# EAGLE design akabeacon_square (EAGLE 7.2.0)
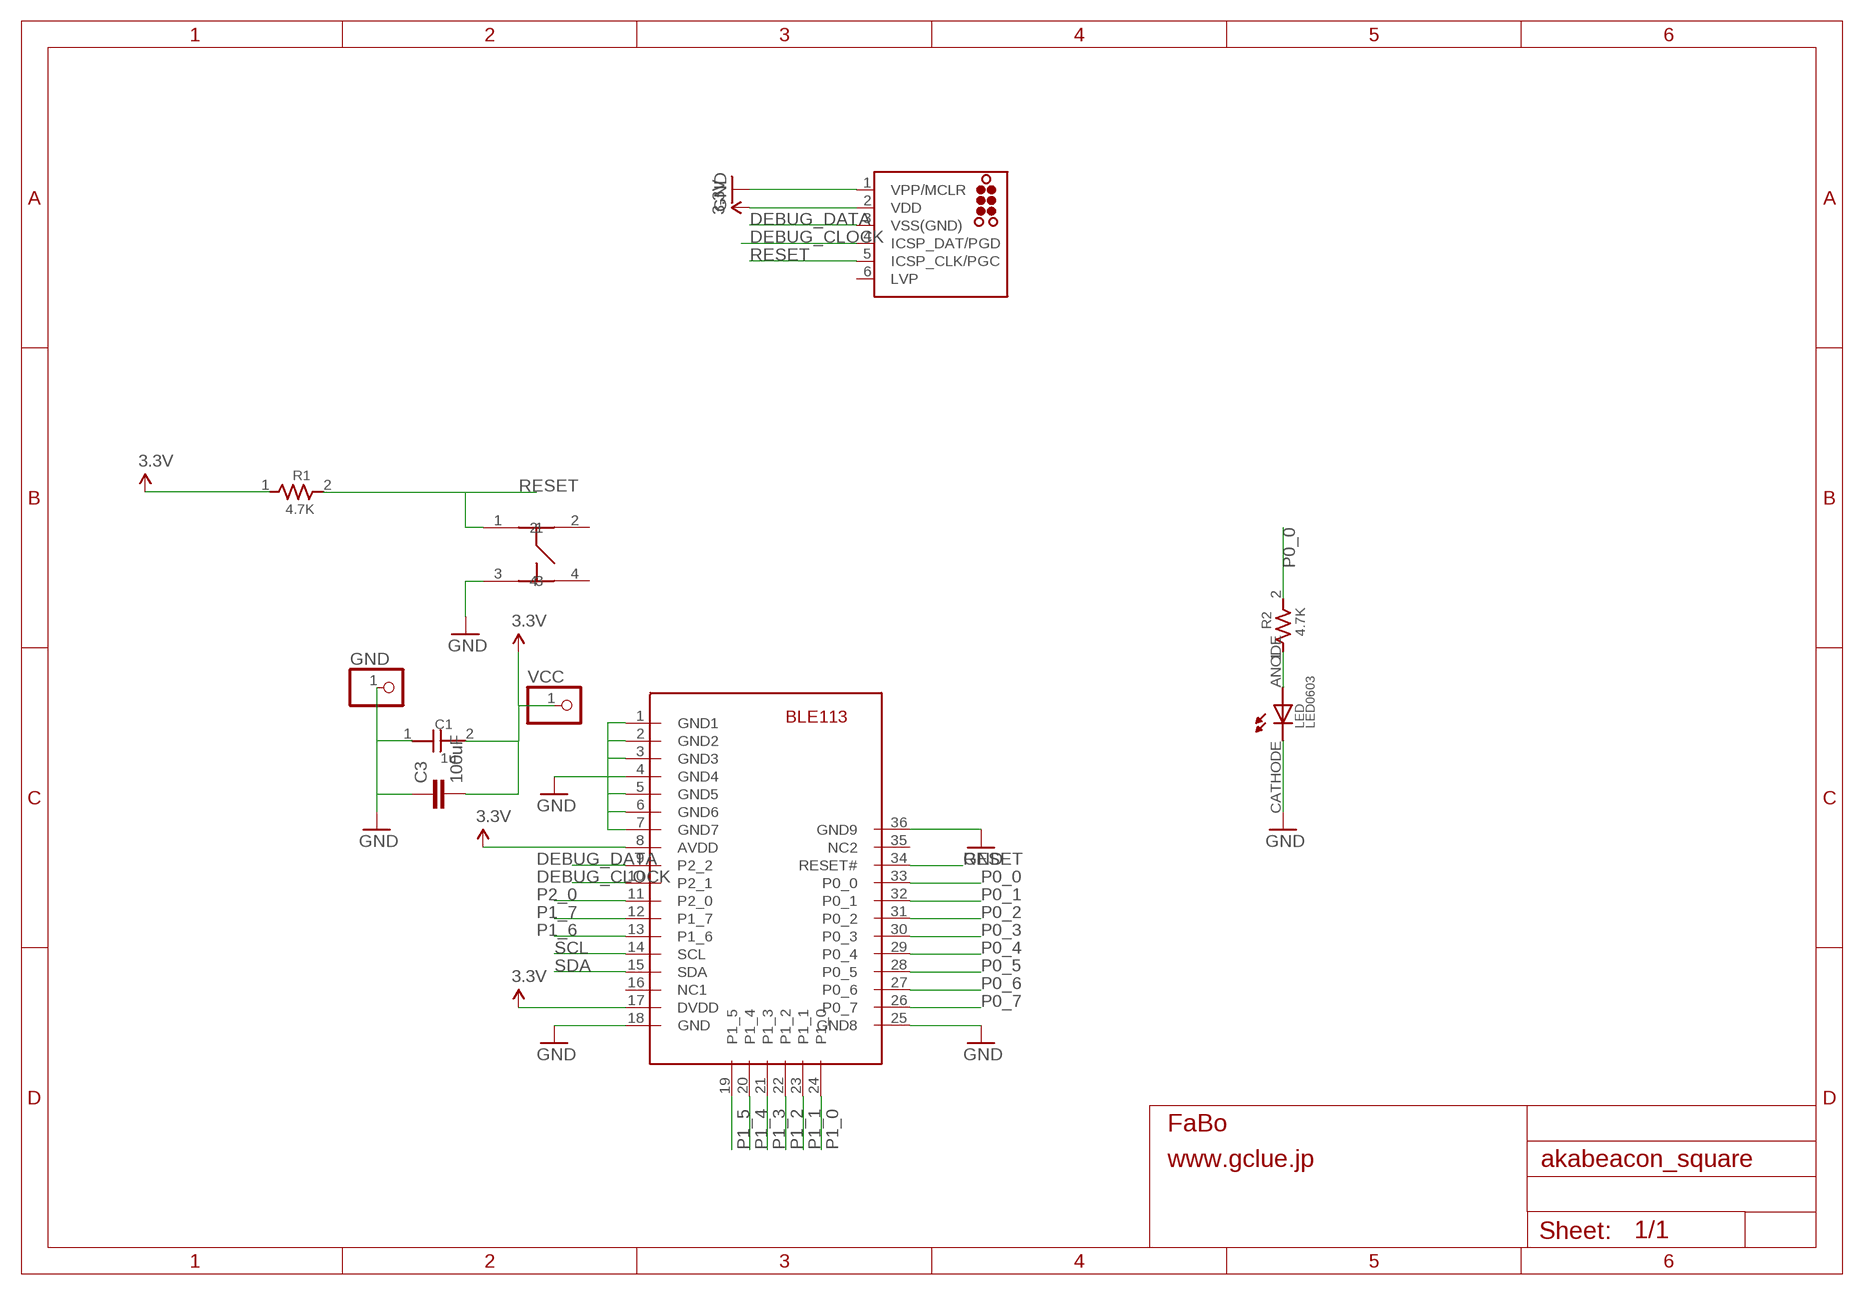
[diagram p0: schematic, sheet 1]

## Parts
C1  1u  CAPACITOR0603  [0603]
C3  100uF  10UF-6.3V-20%(1206)  [1206]
GND  PINHD-1X1CB  [1X01-CLEANBIG]
J1  TC2030-MCP  [TC2030-MCP]
LED  LED0603  [0603]
R1  4.7K  RESISTOR0603  [0603]
R2  4.7K  RESISTOR0603  [0603]
U$5  BLE113  [BLE113]
U$6  SWICTH-4P(KMR2)  [SWITCH-4P(KMR2)]
VCC  PINHD-1X1CB  [1X01-CLEANBIG]

## Nets
3.3V: C1.2 C3.2 J1.2(VDD) R1.1 U$5.8(AVDD) U$5.17(DVDD) VCC.1
DEBUG_CLOCK: J1.4(ICSP_DAT/PGD) U$5.10(P2_1)
DEBUG_DATA: J1.3(VSS(GND)) U$5.9(P2_2)
GND: C1.1 C3.1 GND.1 J1.1(VPP/MCLR) LED.CATHODE U$5.1(GND1) U$5.2(GND2) U$5.3(GND3) U$5.4(GND4) U$5.5(GND5) U$5.6(GND6) U$5.7(GND7) U$5.18(GND) U$5.25(GND8) U$5.36(GND9) U$6.3
N$2: LED.ANODE R2.1
P0_0: R2.2 U$5.33(P0_0)
P0_1: U$5.32(P0_1)
P0_2: U$5.31(P0_2)
P0_3: U$5.30(P0_3)
P0_4: U$5.29(P0_4)
P0_5: U$5.28(P0_5)
P0_6: U$5.27(P0_6)
P0_7: U$5.26(P0_7)
P1_0: U$5.24(P1_0)
P1_1: U$5.23(P1_1)
P1_2: U$5.22(P1_2)
P1_3: U$5.21(P1_3)
P1_4: U$5.20(P1_4)
P1_5: U$5.19(P1_5)
P1_6: U$5.13(P1_6)
P1_7: U$5.12(P1_7)
P2_0: U$5.11(P2_0)
RESET: J1.5(ICSP_CLK/PGC) R1.2 U$5.34(RESET#) U$6.1
SCL: U$5.14(SCL)
SDA: U$5.15(SDA)
Unconnected: J1.6(LVP) U$5.16(NC1) U$5.35(NC2) U$6.2 U$6.4

## Library data of the parts
C1 = GClue-Capacitor:CAPACITOR
C3 = SparkFun-Capacitors:10UF-6.3V-20%(1206): CAP-10057 Ceramic; PROD_ID: CAP-10057; VALUE: 10uF
GND VCC = adafruit:PINHD-1X1: Pin header 1x1 for 0.1" spacing With round pins
J1 = tag-connect:TC2030: TAG-CONNECT ICSP Connector Manufacturer: Tag-Connect <http://www.tag-connect.com> Cable for easy In-Circuit Serial Programming. Designed for Microchip ICD2, suitable for many others. Two variants - one "with legs" (for hands-free fit on PCB) and another "without legs" for quick programming. PAD Description 1 MCLR/Vpp 2 Vdd 3 GND 4 PGD (ISPDAT) 5 PGC (ISPCLK) 6 nc (used for LVP) ©2009 ROFA.cz - modified and updated by Robert Darlington ‹rdarlington@gmail.com›
LED = GClue-LED:LED
R1 R2 = GClue-Resistors:RESISTOR
U$5 = gclue:BLE113
U$6 = gclue:SWICTH-4P(KMR2)

## Board
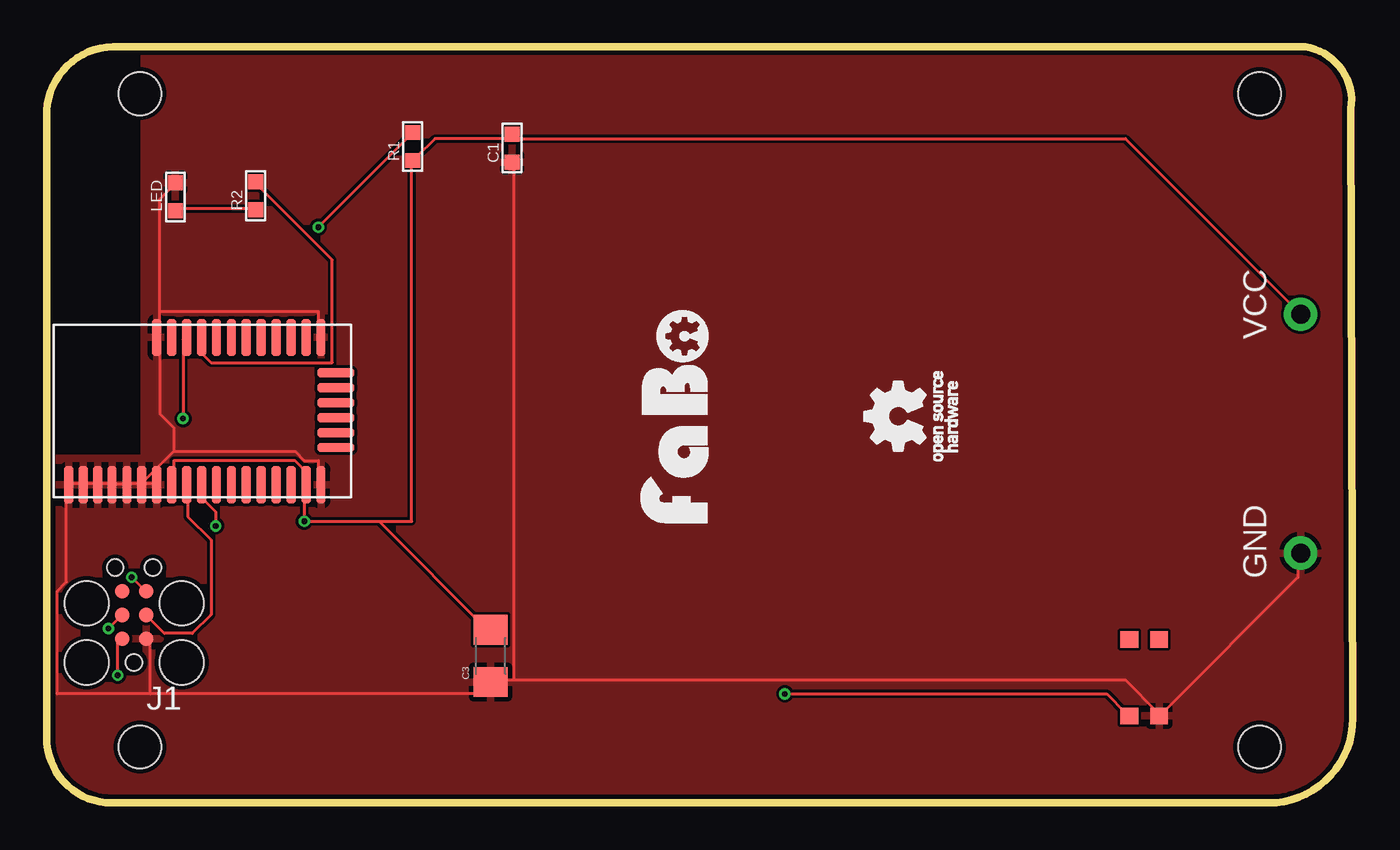
[diagram p1: board, top side]
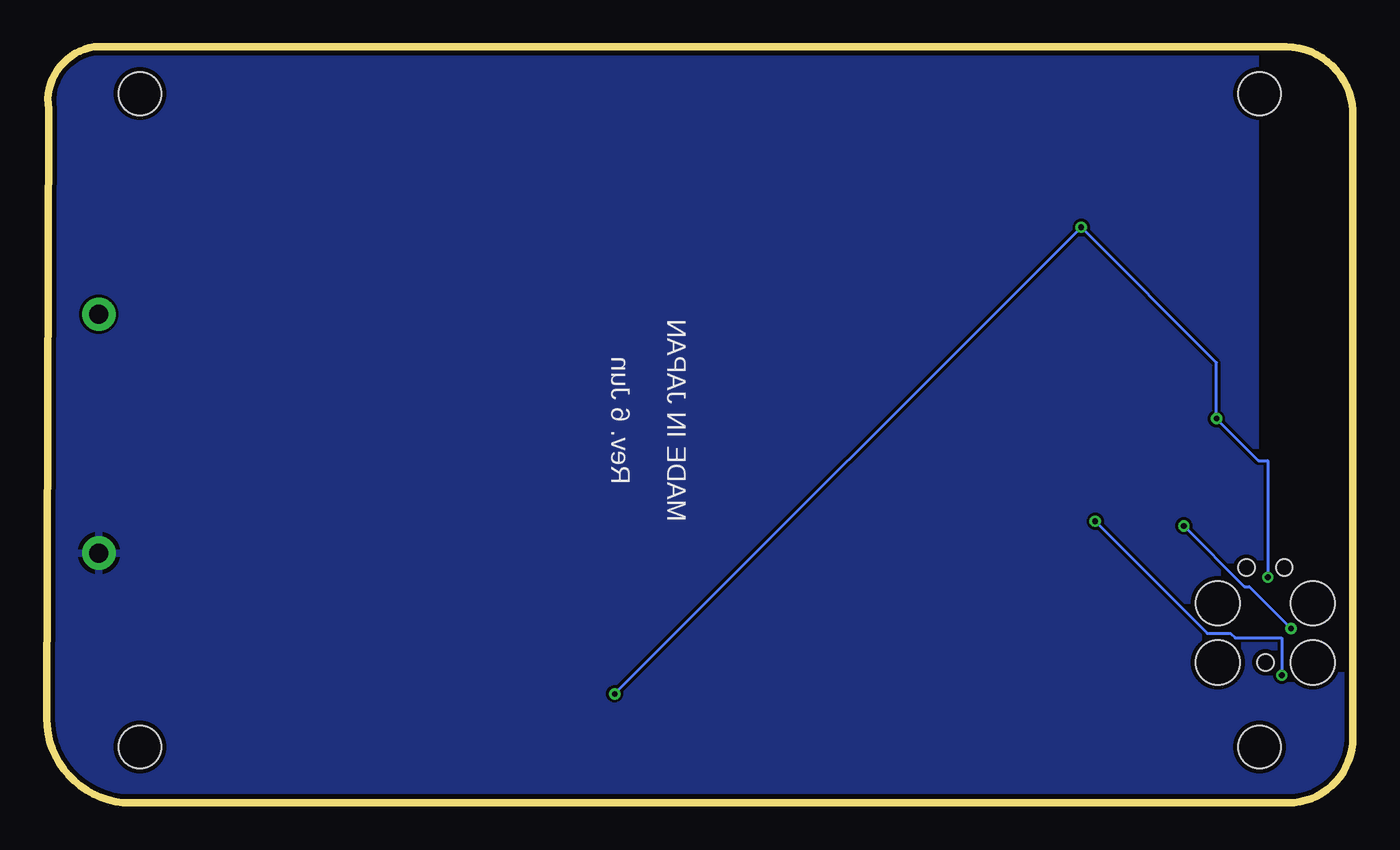
[diagram p2: board, bottom side, seen from below]

Size 70 x 40.52 mm. Coordinates in mm from the lower left corner, seen from the top.
Outline: 0,37.1 0,3.49 arc90 3.49,0 65.47,0 arc90 70,4.53 69.9,37.18 arc90 67.44,40.51 3.89,40.51 arc90 0,37.1
Copper layers (1*16): Top 0.035mm / dielectric 1.5mm / Bottom 0.035mm
Design rules "SeeedStudio_2layer_DRU_no_angle_20140221": minimum track width 6mil, minimum drill 12mil, track to track 6mil, track to pad 6mil, pad to pad 6mil, via to via 6mil, smd to smd 0mil, copper to edge 10mil, drill to drill 10mil, minimum pad ring 10mil, minimum via ring 6mil, stop-mask expansion 2mil, vias tented up to drill 100mil, thermal gap 10mil
Holes 2.3 mm at 5,3 5,38 65,38 65,3
tRestrict: area -5.5,18.7 to 5,42.4
bRestrict: area -5.4,18.6 to 5,42.5

### Footprints (pad centres in the part's own frame; a part is rotated, then mirrored left to right if it is on the bottom)
0603 = smd 0.8 x 0.8: 1 -0.75,0; 2 0.75,0
1206 = smd 1.6 x 1.8: 1 -1.4,0; 2 1.4,0
1X01-CLEANBIG = drill 1.016 pad 1.778: 1 0,0
TC2030-MCP = smd 0.787 x 0.787: 1 1.27,-0.635; 2 1.27,0.635; 3 2.54,-0.635; 4 2.54,0.635; 5 3.81,-0.635; 6 3.81,0.635 | hole 0.889: 0,0; 5.08,-1.016; 5.08,1.016 | hole 2.375: 0,2.54; 0,-2.54; 3.175,-2.54; 3.175,2.54
0603' = smd 0.8 x 0.8: ANODE -0.75,0; CATHODE 0.75,0
BLE113 = smd 2 x 0.5: 1 -5.08,5.08; 2 -5.08,4.31; 3 -5.08,3.54; 4 -5.08,2.77; 5 -5.08,1.97; 6 -5.08,1.17; 7 -5.08,0.37; 8 -5.08,-0.43; 9 -5.08,-1.23; 10 -5.08,-2.03; 11 -5.08,-2.83; 12 -5.08,-3.63; 13 -5.08,-4.43; 14 -5.08,-5.23; 15 -5.08,-6.03; 16 -5.08,-6.83; 17 -5.08,-7.63; 18 -5.08,-8.43; 25 2.82,-8.43; 26 2.82,-7.63; 27 2.82,-6.83; 28 2.82,-6.03; 29 2.82,-5.23; 30 2.82,-4.43; 31 2.82,-3.63; 32 2.82,-2.83; 33 2.82,-2.03; 34 2.82,-1.23; 35 2.82,-0.43; 36 2.82,0.37 | smd 0.5 x 2: 19 -3.08,-9.23; 20 -2.28,-9.23; 21 -1.48,-9.23; 22 -0.68,-9.23; 23 0.12,-9.23; 24 0.92,-9.23
SWITCH-4P(KMR2) = smd 0.9 x 0.95: 1 -1,0; 2 3.1,0; 3 -1,-1.6; 4 3.1,-1.6

### Placement (x,y rotation side)
C1  24.94,35.08 90 top
C3  23.79,7.88 90 top
GND  67.2,13.39 90 top
J1  4.69,7.53 90 top
LED  LED0603  [0603']  6.9,32.47 90 top
R1  19.61,35.17 90 top
R2  11.2,32.53 90 top
U$3  [LOGO_FABO_M]  35.47,20.71 90 top
U$4  [LOGO_OSHW_T_M]  45.65,20.72 90 top
U$5  6.27,22.12 90 top
U$6  58.02,5.66 90 top
VCC  67.2,26.19 90 top

### Tracks (layer width: path | path; a pad name or v marks a point on that pad's centre or on a via)
3.3V  (via drill 0.3)
  Top 0.152: v3.81,6.84 3.81,8.59 J1.2 | 17.81,15.09 23.56,9.34 C3.2 | 17.81,15.09 v13.81,15.09 13.81,16.84 U$5.17 13.81,17.09 13.81,17.84 13.31,18.34 6.81,18.34 6.81,17.09 U$5.8 | 17.81,15.09 19.56,15.09 19.56,34.34 R1.1 19.81,34.59 20.81,35.59 24.81,35.59 C1.2 25.06,35.59 57.81,35.59 67.06,26.34 VCC.1
  Bottom 0.152: v3.81,6.84 3.81,8.84 6.31,8.84 6.56,9.09 7.81,9.09 v13.81,15.09
DEBUG_CLOCK  (via drill 0.3)
  Top 0.152: v3.31,9.34 3.81,9.84 J1.4 | v9.06,14.84 9.06,15.59 8.31,16.34 8.31,16.84 U$5.10
  Bottom 0.152: v3.31,9.34 5.56,11.59 5.81,11.59 v9.06,14.84
DEBUG_DATA
  Top 0.152: J1.3 5.56,9.84 6.31,9.09 7.81,9.09 8.81,10.09 8.81,14.09 7.56,15.34 7.56,16.84 U$5.9
GND
  Top 0.152: U$5.7 5.81,17.09 5.31,17.09 U$5.6 5.06,17.09 | 6.81,18.84 13.31,18.84 13.81,18.34 14.56,18.34 14.56,17.09 U$5.18 | 5.06,17.09 6.81,18.84 | 5.06,17.09 4.31,17.09 U$5.5 4.06,17.09 3.56,17.09 U$5.4 3.31,17.09 2.81,17.09 U$5.3 2.56,17.09 2.06,17.09 U$5.2 1.81,17.09 1.31,17.09 U$5.1 1.06,16.84 1.06,11.84 0.56,11.34 0.56,5.84 5.56,5.84 | 6.06,26.34 6.06,25.09 U$5.36 6.06,24.84 6.06,20.84 6.81,20.09 6.81,18.84 | 6.06,26.34 6.06,32.34 6.81,33.09 LED.CATHODE | 6.06,26.34 14.56,26.34 14.56,25.09 U$5.25 | GND.1 67.06,13.34 67.06,12.09 59.81,4.84 U$6.3 59.56,4.84 57.81,6.59 25.06,6.59 | 5.56,5.84 5.56,8.59 J1.1 | 5.56,5.84 23.06,5.84 23.56,6.34 C3.1 23.81,6.59 25.06,6.59 | 25.06,6.59 25.06,34.09 C1.1
  pour Top: -0.94,-0.66 71.06,-0.66 71.06,41.34 -0.94,41.34
  pour Bottom: -0.94,-0.66 71.06,-0.66 71.06,41.34 -0.94,41.34
N$2
  Top 0.152: LED.ANODE 7.06,31.84 11.06,31.84 R2.1
P0_0
  Top 0.152: R2.2 11.31,33.09 15.31,29.09 15.31,23.59 8.81,23.59 8.31,24.09 8.31,24.84 U$5.33
RESET  (via drill 0.3)
  Top 0.152: v4.56,12.09 J1.5 | v7.31,20.59 7.31,24.84 U$5.34 | v14.56,30.84 19.56,35.84 R1.2 | v39.56,5.84 56.81,5.84 57.81,4.84 U$6.1
  Bottom 0.152: v4.56,12.09 4.56,18.34 5.06,18.34 v7.31,20.59 7.31,23.59 v14.56,30.84 v39.56,5.84

### Text on the board
bPlace: MADE IN JAPAN | Rev. 6 Jun